# Altium schematic sheet Heater & Cal. Laser.SchDoc
size 214 x 146 mm
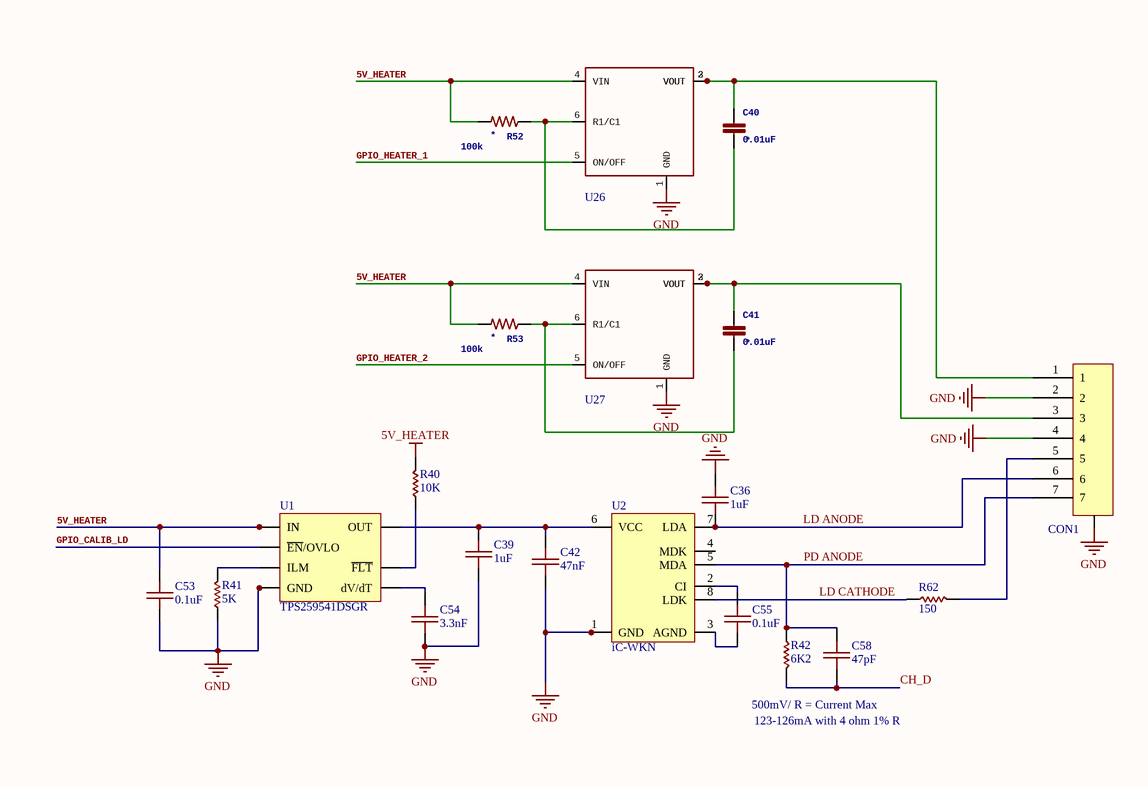
[diagram p0: Heater & Cal. Laser.SchDoc]

## Parts
C36  1uF  [0402 B]
C39  1uF  [0402 B]
C40  0.01uF  [0603]
C41  0.01uF  [0603]
C42  47nF  [0402 B]
C53  0.1uF  [0402 B]
C54  3.3nF  [0402 B]
C55  0.1uF  [0402 B]
C58  47pF  [0402 B]
CON1  T1M-07-F-SH-L-K_1  [T1M-07-F-SH-L-K]  (value not drawn)
R40  10K  [0402]
R41  5K  [0402]
R42  6K2  [0402R]
R52  100k  [0603R]
R53  100k  [0603R]
R62  150  [0402R]
U1  TPS259541DSGR  [SON8 (2x2)]
U2  iC-WKN  [SOIC8tp]
U26  TPS27082L  [TSOT-23 6 Lead]  (value not drawn)
U27  TPS27082L  [TSOT-23 6 Lead]  (value not drawn)

## Nets
5V_HEATER: C53.2 R40.1 R52.2 R53.2 U1.3(IN) U1.4(IN) U26.4(VIN) U27.4(VIN)
GND: C36.2 C39.1 C42.1 C53.1 C54.1 CON1.2 CON1.4 CON1.GND R41.2 U1.8(GND) U1.9 U2.1(GND) U2.9 U26.1(GND) U27.1(GND)
CH_D: C58.1 R42.1
GPIO_CALIB_LD: U1.2(~{EN}/OVLO)
GPIO_HEATER_1: U26.5(ON/OFF)
GPIO_HEATER_2: U27.5(ON/OFF)
LD ANODE: C36.1 CON1.6 U2.7(LDA)
LD CATHODE: R62.2 U2.8(LDK)
PD ANODE: C58.2 CON1.7 R42.2 U2.5(MDA)
NetC39_2: C39.2 C42.2 U1.5(OUT) U2.6(VCC)
NetC40_1: C40.1 CON1.1 U26.2(VOUT) U26.3(VOUT)
NetC40_2: C40.2 R52.1 U26.6(R1/C1)
NetC41_1: C41.1 CON1.3 U27.2(VOUT) U27.3(VOUT)
NetC41_2: C41.2 R53.1 U27.6(R1/C1)
NetC54_2: C54.2 U1.1(dV/dT)
NetC55_1: C55.1 U2.3(AGND)
NetC55_2: C55.2 U2.2(CI)
NetCON1_5: CON1.5 R62.1
NetR40_2: R40.2 U1.6(~{FLT})
NetR41_1: R41.1 U1.7(ILM)

Not connected (* = marked no-connect by the designer): U2 4(MDK)

## Notes on the sheet
- 500mV/ R = Current Max
- 123-126mA with 4 ohm 1% R

## Library data of the parts
C36 C39 C42 C53-C55 C58 = CAP 0402: 402 Capacitor
C40 C41 = C-EUC0603K: CAPACITOR, European symbol; GateName_1: G$1; SymbolName_1: C-EU; DeviceName: C0603K; LibraryName: rcl; DeviceSetName: C-EU; NAME: *
CON1 = T1M-07-F-SH-L-K_1: 6 Positions Header Connector Surface Mount, Right Angle; Manufacturer: Samtec; Manufacturer Part Number: T1M-06-F-SH-L-K; Supplier 1: Digi-Key; Stock 1: 0; Supplier Part Number 1: SAM11991-ND
R40-R42 R62 = RES 0402: 402 Resistor
R52 R53 = R-US_R0603: RESISTOR, American symbol; GateName_1: G$1; SymbolName_1: R-US; DeviceName: R0603; DeviceSetName: R-US_; LibraryName: rcl; NAME: *
U1 = TPS2595x3
U26 U27 = TPS27082L: GateName_1: G$1; SymbolName_1: TPS27082L; LibraryName: custom; DeviceSetName: TPS27082L